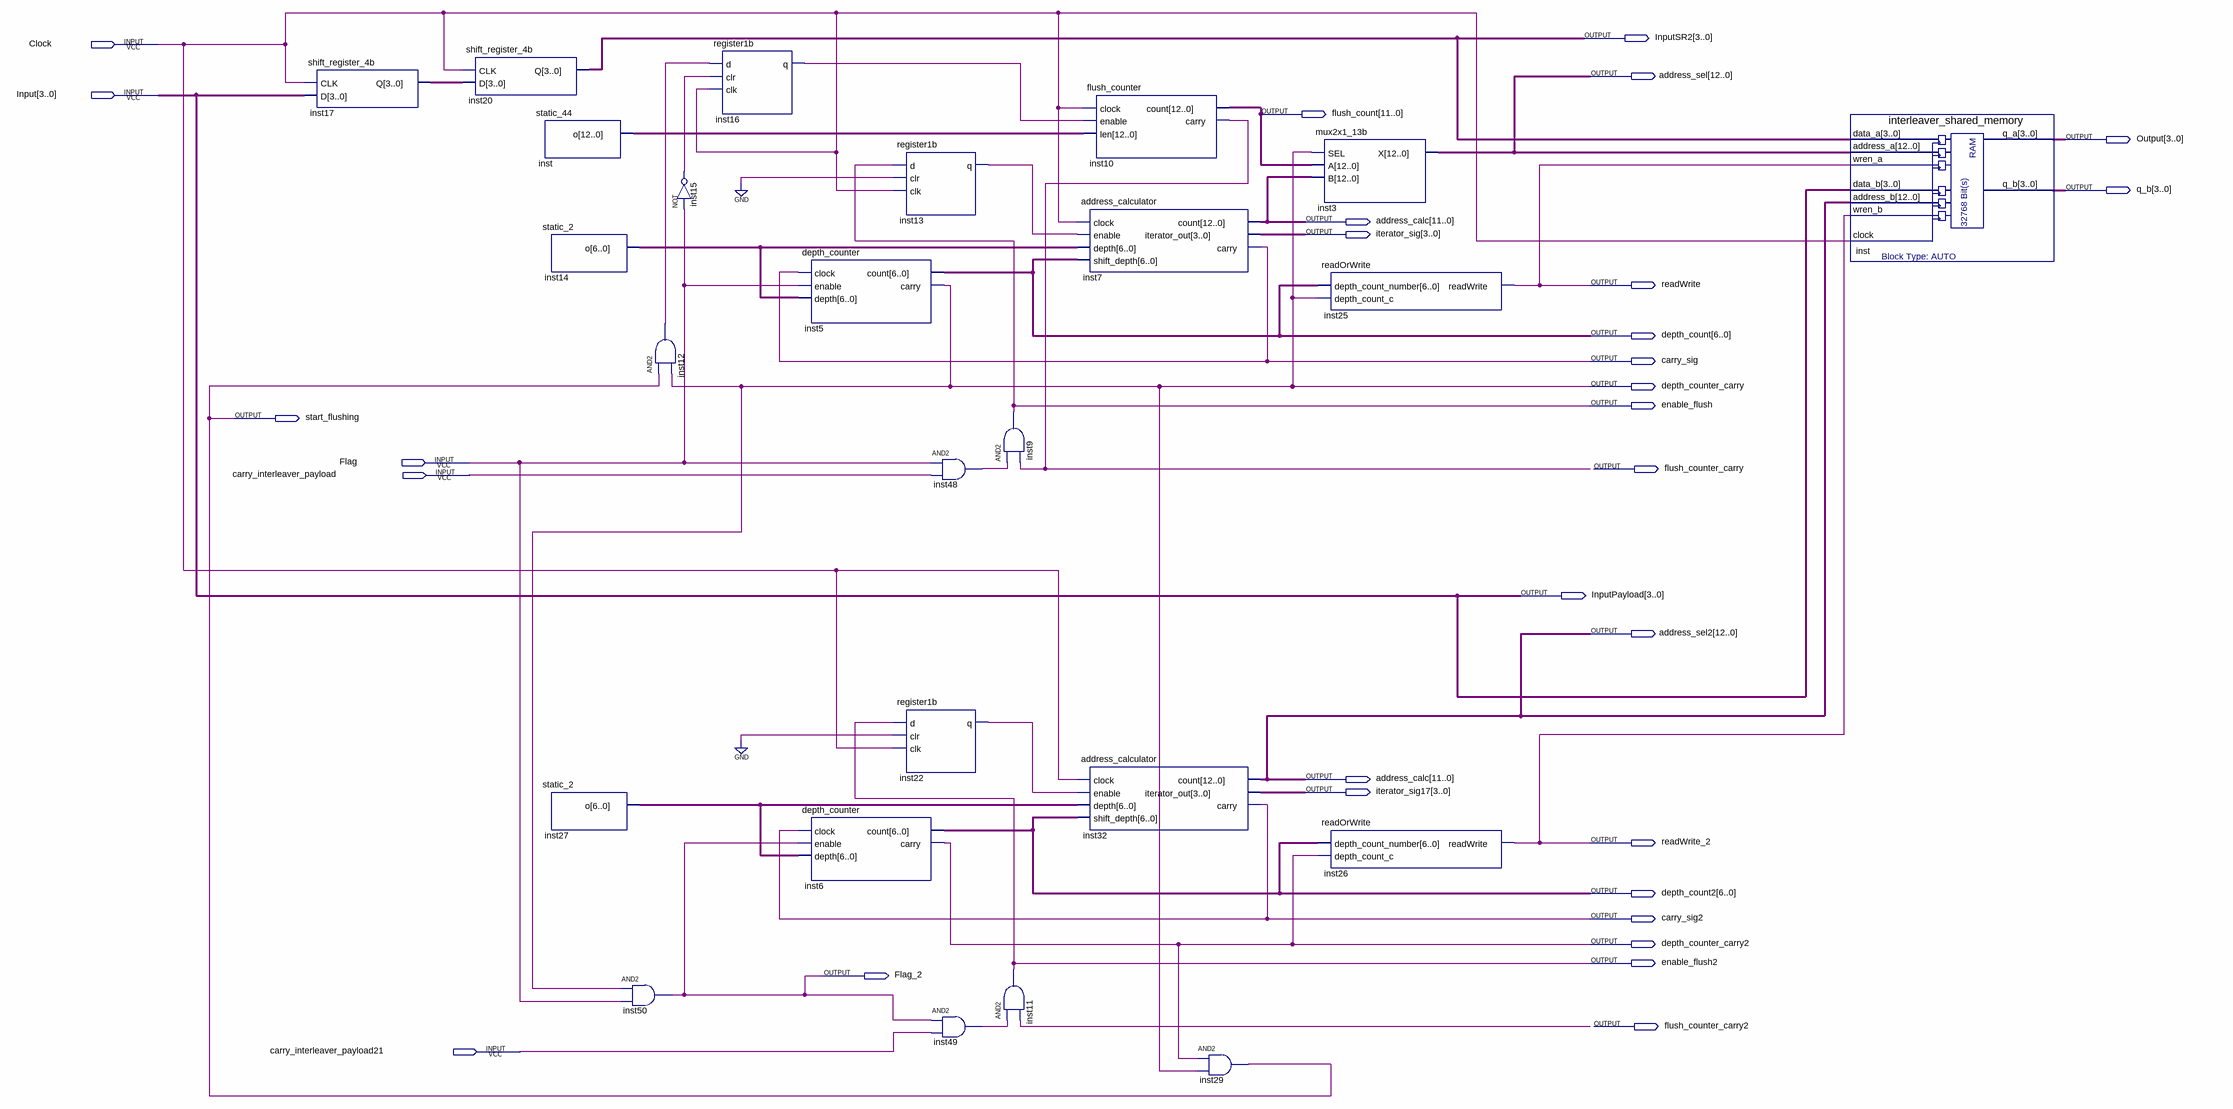
[diagram p0: schematic sheet]
// Quartus schematic interleaver_rev4_backup.bdf as structural Verilog: 25 symbols, 30 pins
module interleaver_rev4_backup (
  input  Clock,
  input  [3:0] Input,
  input  Flag,
  input  carry_interleaver_payload,
  input  carry_interleaver_payload21,
  output [3:0] InputSR2,
  output [12:0] address_sel,
  output [11:0] flush_count,
  output [3:0] Output,
  output [3:0] q_b,
  output [11:0] address_calc,
  output [3:0] iterator_sig,
  output readWrite,
  output [6:0] depth_count,
  output carry_sig,
  output depth_counter_carry,
  output enable_flush,
  output start_flushing,
  output flush_counter_carry,
  output [3:0] InputPayload,
  output [12:0] address_sel2,
  output [3:0] iterator_sig17,
  output readWrite_2,
  output [6:0] depth_count2,
  output carry_sig2,
  output depth_counter_carry2,
  output enable_flush2,
  output Flag_2,
  output flush_counter_carry2
);

  wire inst12_out, inst13_q, inst15_out, inst16_q, inst22_q, inst48_out, inst49_out;
  wire [3:0] inst17_q;
  wire [6:0] inst14_o, inst27_o;
  wire [12:0] inst_o;

  shift_register_4b inst17 (.CLK(Clock), .D(Input), .Q(inst17_q));
  shift_register_4b inst20 (.CLK(Clock), .D(inst17_q), .Q(InputSR2));
  static_44 inst (.o(inst_o));
  static_2 inst14 (.o(inst14_o));
  static_2 inst27 (.o(inst27_o));
  and inst50 (Flag_2, depth_counter_carry, Flag);
  not inst15 (inst15_out, Flag);
  and inst12 (inst12_out, start_flushing, depth_counter_carry);
  register1b inst16 (.d(inst12_out), .clr(inst15_out), .clk(Clock), .q(inst16_q));
  depth_counter inst5 (
    .clock(carry_sig), .enable(Flag), .depth(inst14_o), .count(depth_count), .carry(depth_counter_carry));
  depth_counter inst6 (
    .clock(carry_sig2), .enable(Flag_2), .depth(inst27_o), .count(depth_count2), .carry(depth_counter_carry2));
  register1b inst13 (.d(enable_flush), .clr(1'b0), .clk(Clock), .q(inst13_q));
  register1b inst22 (.d(enable_flush2), .clr(1'b0), .clk(Clock), .q(inst22_q));
  and inst48 (inst48_out, Flag, carry_interleaver_payload);
  and inst49 (inst49_out, Flag_2, carry_interleaver_payload21);
  and inst9 (enable_flush, inst48_out, flush_counter_carry);
  and inst11 (enable_flush2, inst49_out, flush_counter_carry2);
  flush_counter inst10 (
    .clock(Clock), .enable(inst16_q), .len(inst_o), .count(flush_count), .carry(flush_counter_carry));
  address_calculator inst7 (
    .clock(Clock), .enable(inst13_q), .depth(inst14_o), .shift_depth(depth_count), .count(address_calc),
    .iterator_out(iterator_sig), .carry(carry_sig));
  address_calculator inst32 (
    .clock(Clock), .enable(inst22_q), .depth(inst27_o), .shift_depth(depth_count2), .count(address_sel2),
    .iterator_out(iterator_sig17), .carry(carry_sig2));
  and inst29 (start_flushing, depth_counter_carry2, depth_counter_carry);
  mux2x1_13b inst3 (.SEL(depth_counter_carry), .A(flush_count), .B(address_calc), .X(address_sel));
  readOrWrite inst25 (.depth_count_number(depth_count), .depth_count_c(depth_counter_carry), .readWrite(readWrite));
  readOrWrite inst26 (.depth_count_number(depth_count2), .depth_count_c(depth_counter_carry2), .readWrite(readWrite_2));
  interleaver_shared_memory inst_dup2 (
    .data_a(InputSR2), .address_a(address_sel), .wren_a(readWrite), .data_b(Input), .address_b(address_sel2),
    .wren_b(readWrite_2), .clock(Clock), .q_a(Output), .q_b(q_b));

  assign InputPayload = Input;
endmodule
